# Altium schematic sheet radio.SchDoc: LoRa Radio Module
size A4; Author: Gerald Ebmer; DrawnBy: Gerald Ebmer; Engineer: Gerald Ebmer; Revision: 1.1; SheetNumber: 4; SheetTotal: 6; PageSetup: Record=PageOptions|CenterHorizontal=True|CenterVertical=True|PrintScale=1.00|XCorrection=1.00|YCorrection=1.00|PrintKind=0|BorderSize=5000000|LeftOffset=0|BottomOffset=0|Orientation=2|PaperLength=1000|PaperWidth=1000|Scale=100|PaperSource=7|PrintQuality=-3|MediaType=1|DitherType=10|PrintScaleMode=1|PaperKind=A4|PaperIndex=9
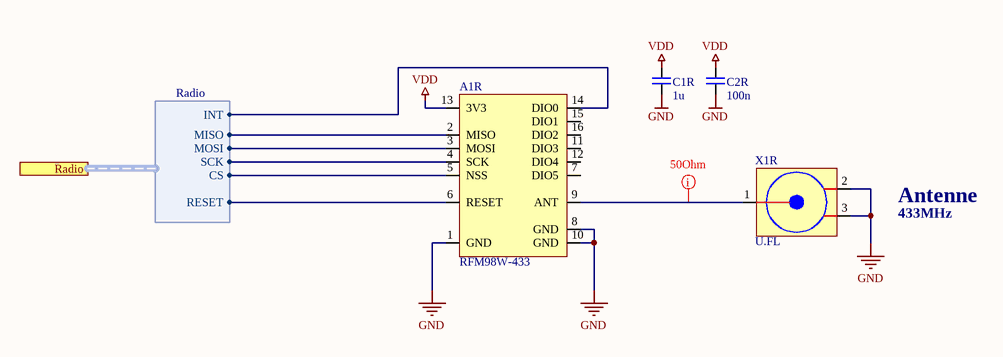
[diagram p0: radio.SchDoc]

## Parts
A1R  RFM98W-433  [RFM98W]
C1R  1u  [0805]
C2R  100n  [0805]
X1R  U.FL  [UFL]

## Ports
Radio (harness Radio)

## Harnesses
Radio: CS, INT, MISO, MOSI, RESET, SCK

## Nets
GND: A1R.1(GND) A1R.8(GND) A1R.10(GND) C1R.1 C2R.1 X1R.2(GND) X1R.3(GND)
VDD: A1R.13(3V3) C1R.2 C2R.2
NetA1R_2: A1R.2(MISO) ; port Radio.MISO
NetA1R_3: A1R.3(MOSI) ; port Radio.MOSI
NetA1R_4: A1R.4(SCK) ; port Radio.SCK
NetA1R_5: A1R.5(NSS) ; port Radio.CS
NetA1R_6: A1R.6(RESET) ; port Radio.RESET
NetA1R_9: A1R.9(ANT) X1R.1(Signal)
NetA1R_14: A1R.14(DIO0) ; port Radio.INT

Not connected (* = marked no-connect by the designer): A1R 7(DIO5) 11(DIO3) 12(DIO4) 15(DIO1) 16(DIO2)

## Layout directives
net class Undefined: NetA1R_9

## Notes on the sheet
- 433MHz
- Antenne
- Title
- Size:
- Date:
- A4
- Number:
- Time:
- Revision:
- Sheet
- of
- File:

## Library data of the parts
A1R = RFM98W: LoRa Module / 433 MHz; Bestell-Nr.: RFM98W-433S2; Hersteller: HOPE MICROELECTRONICS; Lieferant: TME; Bauform: *; Bezeichnung: RFM98W-433S2; Preis: *
C1R = Kondensator: Bezeichnung: C0805C105K3RACTU; Hersteller: KEMET; Lieferant: Farnell; Bestell-Nr.: 1637035; Bauform: 0805
C2R = Kondensator: Bezeichnung: 08055C104KAT2A; Hersteller: AVX; Lieferant: RS Components; Bestell-Nr.: 464-6688; Bauform: 0805
X1R = U.FL: Hersteller: HIROSE(HRS); Lieferant: Farnell; Bauform: SMD; Bezeichnung: U.FL-R-SMT-1(10); Bestell-Nr.: 1688077; Preis: *